# EAGLE design Proto-v2.1 - TO-92 (EAGLE 7.1.0)
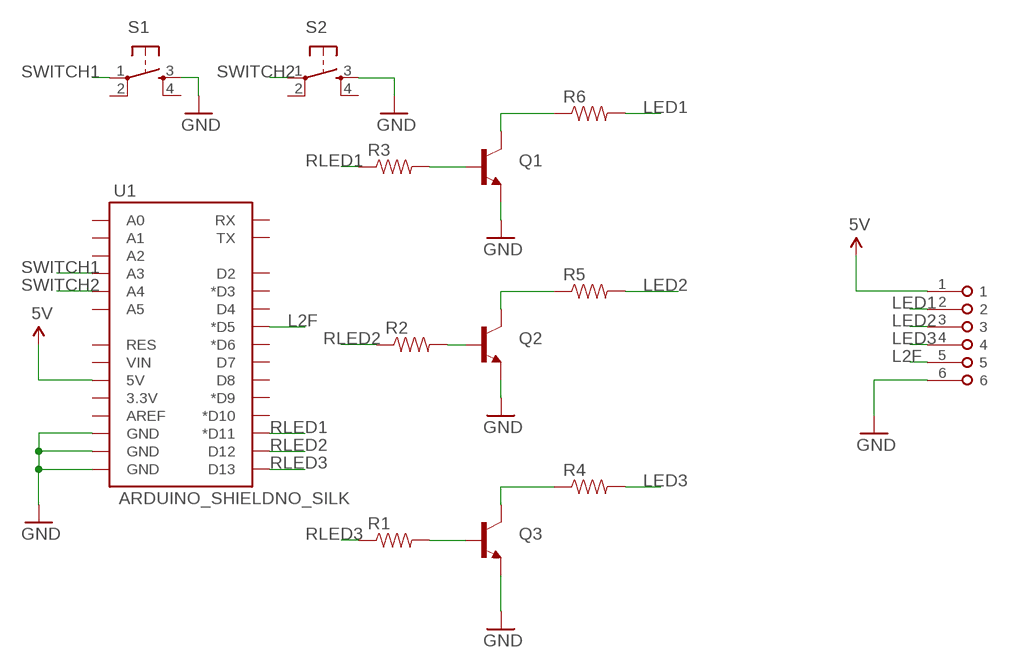
[diagram p0: schematic, sheet 1]

## Parts
Q1  TRANSISTOR_NPNBC547  [TO-92-AMMO]
Q2  TRANSISTOR_NPNBC547  [TO-92-AMMO]
Q3  TRANSISTOR_NPNBC547  [TO-92-AMMO]
R1  RESISTORAXIAL-0.3  [AXIAL-0.3]
R2  RESISTORAXIAL-0.3  [AXIAL-0.3]
R3  RESISTORAXIAL-0.3  [AXIAL-0.3]
R4  RESISTORAXIAL-0.3  [AXIAL-0.3]
R5  RESISTORAXIAL-0.3  [AXIAL-0.3]
R6  RESISTORAXIAL-0.3  [AXIAL-0.3]
S1  TAC_SWITCHPTH  [TACTILE-PTH]
S2  TAC_SWITCHPTH  [TACTILE-PTH]
U1  ARDUINO_SHIELDNO_SILK  [DUEMILANOVE_VIAS]
U$1  TERMINAL-6  [MBE-156]

## Nets
5V: U1.5V U$1.1
GND: Q1.3(E) Q2.3(E) Q3.3(E) S1.3 S2.3 U1.GND@0(GND) U1.GND@1(GND) U1.GND@2(GND) U$1.6
L2F: U1.D5(*D5) U$1.5
LED1: R6.P$2 U$1.2
LED2: R5.P$2 U$1.3
LED3: R4.P$2 U$1.4
N$4: Q3.2(B) R1.P$2
N$5: Q2.2(B) R2.P$2
N$6: Q3.1(C) R4.P$1
N$7: Q2.1(C) R5.P$1
N$11: Q1.2(B) R3.P$2
N$12: Q1.1(C) R6.P$1
RLED1: R3.P$1 U1.D11(*D11)
RLED2: R2.P$1 U1.D12
RLED3: R1.P$1 U1.D13
SWITCH1: S1.1 U1.A3
SWITCH2: S2.1 U1.A4
Unconnected: S1.2 S1.4 S2.2 S2.4 U1.3.3V U1.A0 U1.A1 U1.A2 U1.A5 U1.AREF U1.D2 U1.D3(*D3) U1.D4 U1.D6(*D6) U1.D7 U1.D8 U1.D9(*D9) U1.D10(*D10) U1.RES U1.RX U1.TX U1.VIN

## Library data of the parts
Q1-Q3 = SparkFun-DiscreteSemi:TRANSISTOR_NPN: Generic NPN BJT MMBT2222A - TRANS-08049 (SOT-23, 1A 40V) MPSA42 - TRANS-09116 (SOT-23, 500mA 300V) MMBT5088LT1G - TRANS-11160 (SOT-23, 50 mA 30V) BC547 - COM-08928 <http://www.sparkfun.com/products/8928> (TO-92 45V 100mA) (1.Collector 2.Base 3.Emitter) 2N3904 - COM-00521 <http://www.sparkfun.com/products/521> (TO-92 40V 200mA) (1.Emitter 2.Base 3.Collector) P2N2222A - COM-12852 <http://www.sparkfun.com/products/12852> (TO-92 40V 600mA) (1.Collector 2.Base 3.Emitter)
R1-R6 = SparkFun-Resistors:RESISTOR: Resistor Basic schematic elements and footprints for 0603, 1206, and PTH resistors.
S1 S2 = SparkFun-Electromechanical:TAC_SWITCH: Momentary Switch Button commonly used for reset or general input. Spark Fun Electronics SKU : COM-00097 SMT- SWCH-08247
U1 = SparkFun-Boards:ARDUINO_SHIELD: Arduino shield footprint
U$1 = Robin:TERMINAL-6

## Board
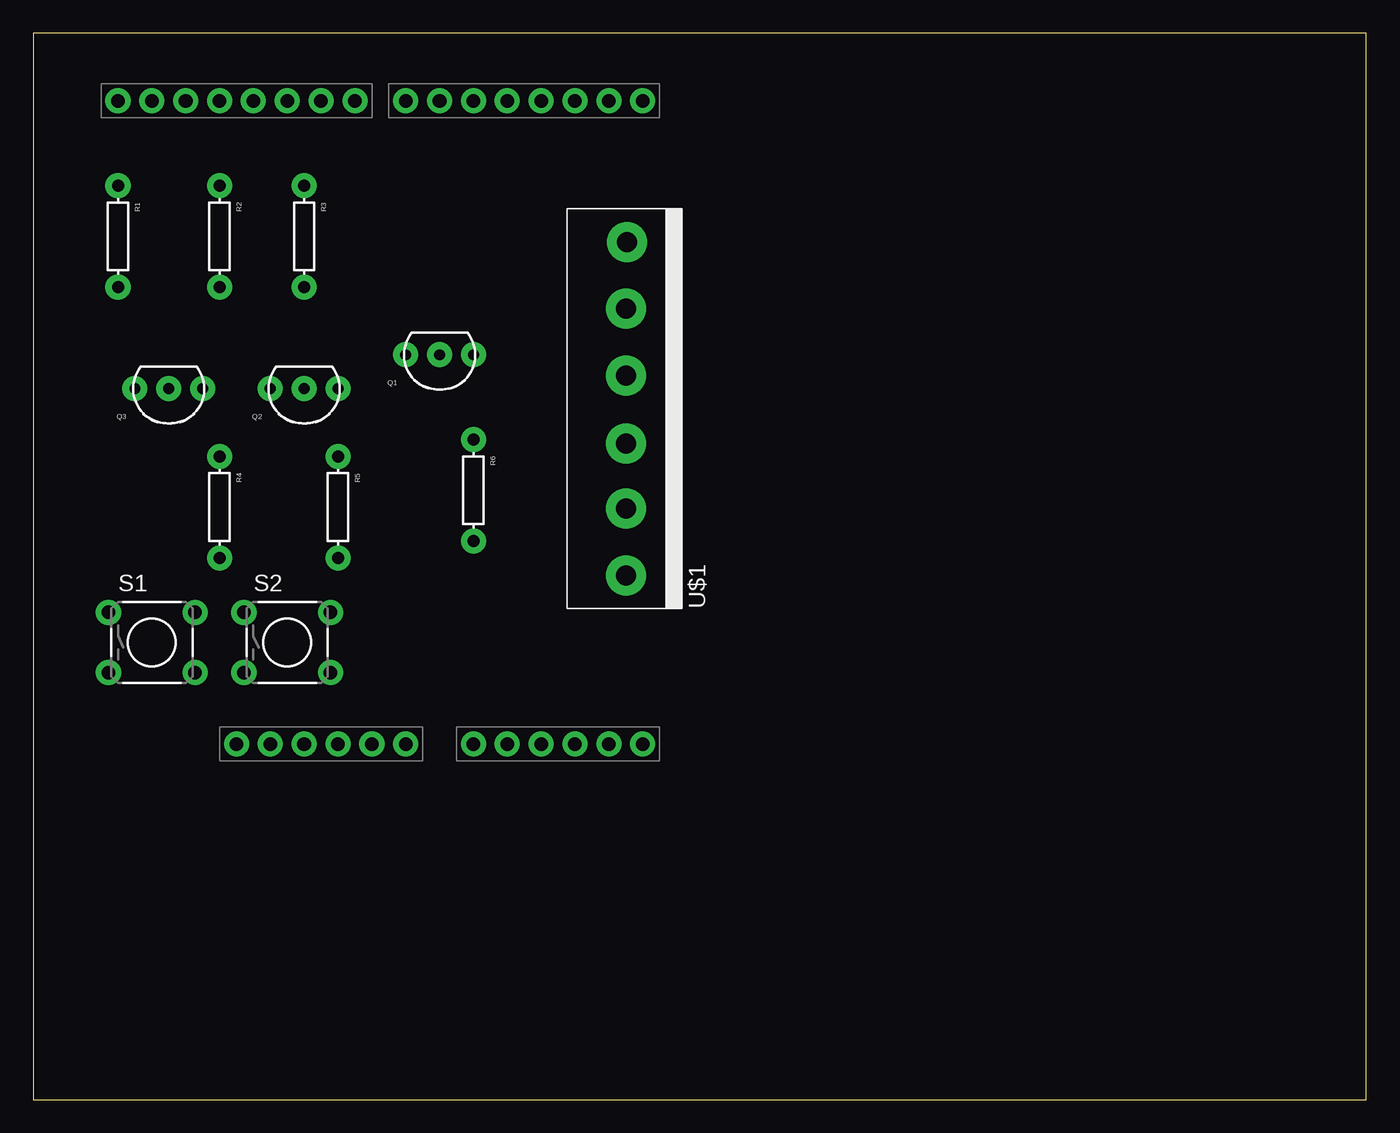
[diagram p1: board, top side]
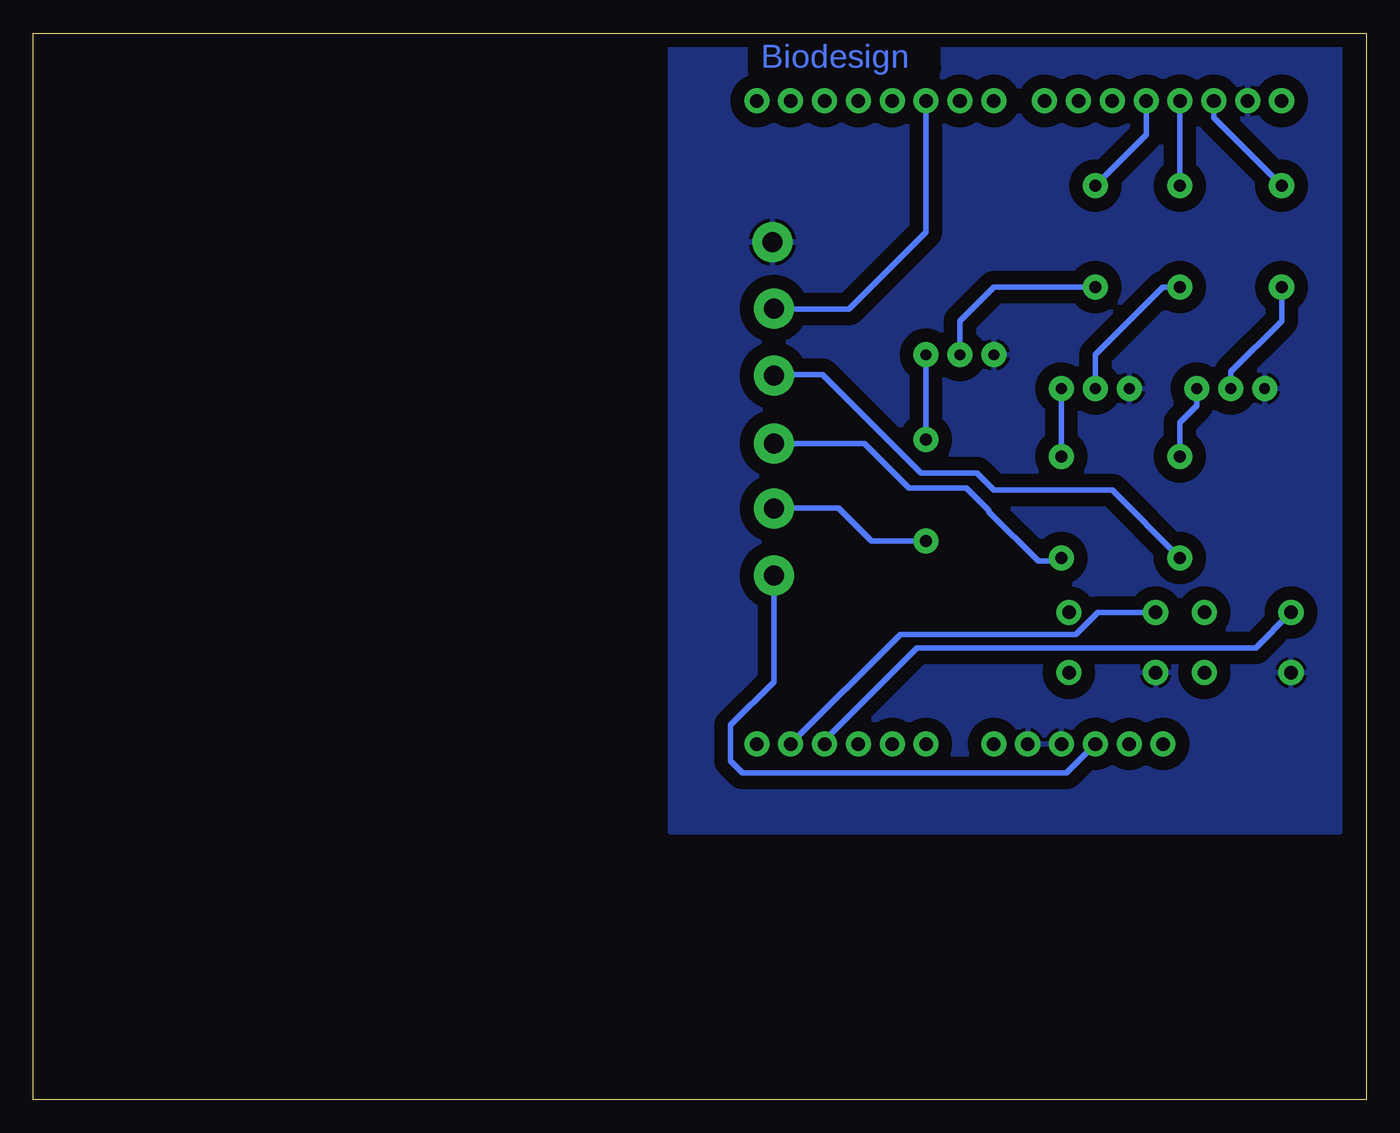
[diagram p2: board, bottom side, seen from below]

Size 100 x 80 mm. Coordinates in mm from the lower left corner, seen from the top.
Outline: 0,0 100,0 100,80 0,80 0,0
Copper layers (1*16): Top 0.035mm / dielectric 1.5mm / Bottom 0.035mm
Design rules "default": minimum track width 10mil, minimum drill 24mil, track to track 8mil, track to pad 8mil, pad to pad 8mil, via to via 8mil, smd to smd 8mil, copper to edge 40mil, drill to drill 8mil, minimum pad ring 10mil, minimum via ring 8mil, stop-mask expansion 4mil, vias tented up to drill 0mil, thermal gap 10mil

### Footprints (pad centres in the part's own frame; a part is rotated, then mirrored left to right if it is on the bottom)
TO-92-AMMO = drill 0.813 pad 1.88: 1 -2.54,0; 2 0,0; 3 2.54,0
AXIAL-0.3 = drill 0.9 pad 1.88: P$1 -3.81,0; P$2 3.81,0
TACTILE-PTH = drill 1.016 pad 1.88: 1 -3.251,2.261; 2 3.251,2.261; 3 -3.251,-2.261; 4 3.251,-2.261
DUEMILANOVE_VIAS = drill 1.016 pad 1.88: 3.3V 50.8,13.97; 5V 50.8,16.51; A0 50.8,29.21; A1 50.8,31.75; A2 50.8,34.29; A3 50.8,36.83; A4 50.8,39.37; A5 50.8,41.91; AREF 2.54,2.54; D2 2.54,36.83; D3 2.54,34.29; D4 2.54,31.75; D5 2.54,29.21; D6 2.54,26.67; D7 2.54,24.13; D8 2.54,20.32; D9 2.54,17.78; D10 2.54,15.24; D11 2.54,12.7; D12 2.54,10.16; D13 2.54,7.62; GND@0 50.8,19.05; GND@1 50.8,21.59; GND@2 2.54,5.08; RES 50.8,11.43; RX 2.54,41.91; TX 2.54,39.37; VIN 50.8,24.13
MBE-156 = drill 1.5 pad 3: 1 2.5,0; 2 7.5,0; 3 12.4,0; 4 17.5,0; 5 22.5,0; 6 27.5,-0.1

### Placement (x,y rotation side)
Q1  30.48,55.88 180 top
Q2  20.32,53.34 180 top
Q3  10.16,53.34 180 top
R1  6.35,64.77 270 top
R2  13.97,64.77 270 top
R3  20.32,64.77 270 top
R4  13.97,44.45 270 top
R5  22.86,44.45 270 top
R6  33.02,45.72 270 top
S1  8.89,34.29 0 top
S2  19.05,34.29 0 top
U1  3.81,77.47 270 top
U$1  44.45,36.83 90 top

### Tracks (layer width: path | path; a pad name or v marks a point on that pad's centre or on a via)
5V
  Bottom 0.406: U$1.1 44.45,31.35 47.7,28.1 47.7,25.4 46.8,24.5 22.49,24.5 U1.5V
GND
  pour Bottom (isolate 1.016): 2.4,79.6 52.2,79.6 52.2,20.1 2,20.1 2,79.6
L2F
  Bottom 0.406: U1.D5 33.02,65.08 38.8,59.3 44.42,59.3 U$1.5
LED1
  Bottom 0.406: R6.P$2 37.11,41.91 39.6,44.4 44.38,44.4 U$1.2
LED2
  Bottom 0.406: U$1.3 37.63,49.23 34.3,45.9 30,45.9 28.3,44.2 28.3,44.1 24.6,40.4 23.1,40.4 R5.P$2
LED3
  Bottom 0.406: R4.P$2 19.05,45.72 27.94,45.72 29.21,46.99 33.39,46.99 40.8,54.4 44.38,54.4 U$1.4
N$4
  Bottom 0.406: R1.P$2 6.35,58.42 10.16,54.61 Q3.2
N$5
  Bottom 0.406: R2.P$2 15.24,60.96 20.32,55.88 Q2.2
N$6
  Bottom 0.406: Q3.1 12.7,52.07 13.97,50.8 R4.P$1
N$7
  Bottom 0.406: Q2.1 R5.P$1
N$11
  Bottom 0.406: R3.P$2 27.94,60.96 30.48,58.42 Q1.2
N$12
  Bottom 0.406: Q1.1 R6.P$1
RLED1
  Bottom 0.406: U1.D11 16.51,72.39 R3.P$1
RLED2
  Bottom 0.406: R2.P$1 U1.D12
RLED3
  Bottom 0.406: U1.D13 11.43,73.66 R1.P$1
SWITCH1
  Bottom 0.406: U1.A3 40.64,26.96 33.7,33.9 8.29,33.9 S1.1
SWITCH2
  Bottom 0.406: S2.1 20.15,36.55 21.8,34.9 34.95,34.9 U1.A4

### Text on the board
Bottom: Biodesign